# EAGLE design Encoder_AS5145B (EAGLE 6.6.0)
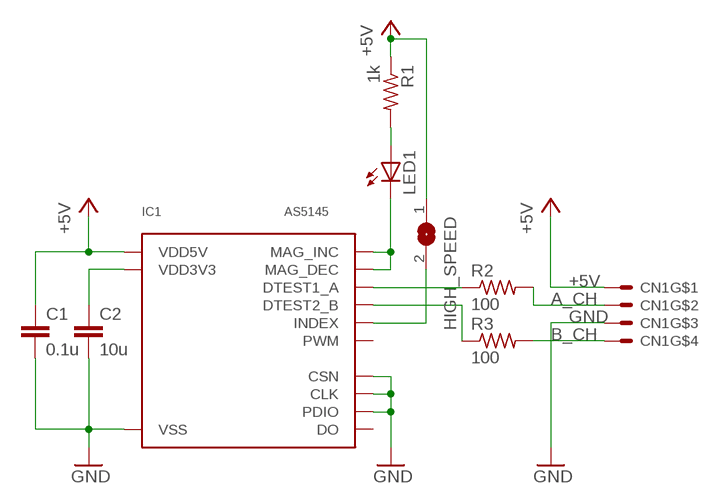
[diagram p0: schematic, sheet 1]

## Parts
C1  0.1u  C-EUC0603  [C0603]
C2  10u  CC2012  [C2012]
CN1  4B-XH-AS4B  [S4B-XH-A]
HIGH_SPEED  SJ  [SJ]
IC1  AS5145  [SSOP16-WIDE]
LED1  LEDCHIPLED_0805  [CHIPLED_0805]
R1  1k  R-US_R1608  [R1608]
R2  100  R-US_R1608  [R1608]
R3  100  R-US_R1608  [R1608]

## Nets
+5V: C1.1 CN1.1 HIGH_SPEED.1 IC1.16(VDD5V) R1.1
A_CH: CN1.2 R2.2
B_CH: CN1.4 R3.2
GND: C1.2 C2.2 CN1.3 IC1.7(VSS) IC1.8(PDIO) IC1.10(CLK) IC1.11(CSN)
N$1: LED1.A R1.2
N$2: IC1.4(DTEST2_B) R3.1
N$3: IC1.3(DTEST1_A) R2.1
N$7: HIGH_SPEED.2 IC1.6(INDEX)
N$8: C2.1 IC1.15(VDD3V3)
N$10: IC1.1(MAG_INC) IC1.2(MAG_DEC) LED1.C
Unconnected: IC1.5(NC1) IC1.9(DO) IC1.12(PWM) IC1.13(NC1) IC1.14(NC1)

## Library data of the parts
C1 = rcl:C-EU: CAPACITOR, European symbol
C2 = capacitor:C: CAPACITOR naming: grid - package width
CN1 = Con-JST:*4B-XH-A
HIGH_SPEED = Jumper:SJ: SMD solder JUMPER
IC1 = encoder:AS5145
LED1 = led:LED: LED OSRAM: - CHIPLED LG R971, LG N971, LY N971, LG Q971, LY Q971, LO R971, LY R971 LH N974, LH R974 LS Q976, LO Q976, LY Q976 LO Q996 - Hyper CHIPLED LW Q18S LB Q993, LB Q99A, LB R99A - SideLED LS A670, LO A670, LY A670, LG A670, LP A670 LB A673, LV A673, LT A673, LW A673 LH A674 LY A675 LS A676, LA A676, LO A676, LY A676, LW A676 LS A679, LY A679, LG A679 - Hyper Micro SIDELED® LS Y876, LA Y876, LO Y876, LY Y876 LT Y87S - SmartLED LW L88C, LW L88S LB L89C, LB L89S, LG L890 LS L89K, LO L89K, LY L89K LS L896, LA L896, LO L896, LY L896 - TOPLED LS T670, LO T670, LY T670, LG T670, LP T670 LSG T670, LSP T670, LSY T670, LOP T670, LYG T670 LG T671, LOG T671, LSG T671 LB T673, LV T673, LT T673, LW T673 LH T674 LS T676, LA T676, LO T676, LY T676, LB T676, LH T676, LSB T676, LW T676 LB T67C, LV T67C, LT T67C, LS T67K, LO T67K, LY T67K, LW E67C LS E67B, LA E67B, LO E67B, LY E67B, LB E67C, LV E67C, LT E67C LW T67C LS T679, LY T679, LG T679 LS T770, LO T770, LY T770, LG T770, LP T770 LB T773, LV T773, LT T773, LW T773 LH T774 LS E675, LA E675, LY E675, LS T675 LS T776, LA T776, LO T776, LY T776, LB T776 LHGB T686 LT T68C, LB T68C - Hyper Mini TOPLED® LB M676 - Mini TOPLED Santana® LG M470 LS M47K, LO M47K, LY M47K Source: http://www.osram.convergy.de/
R1-R3 = Registor:R-US_: RESISTOR, American symbol

## Board
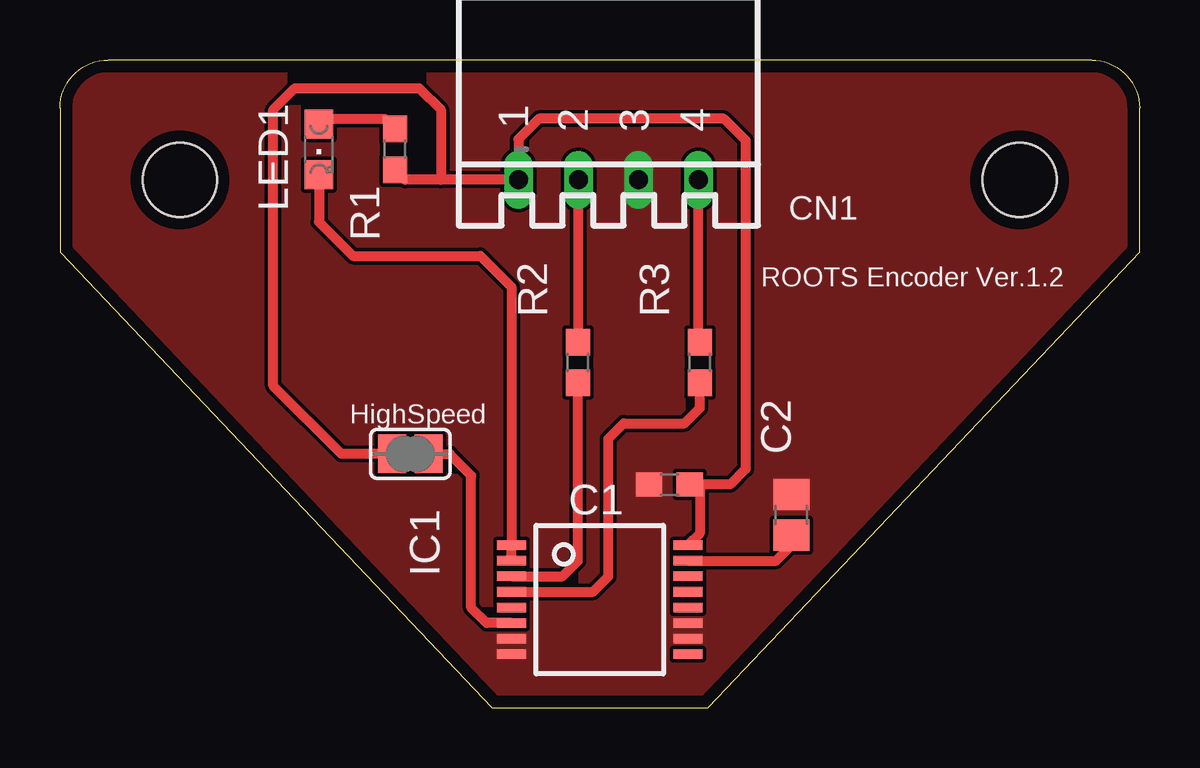
[diagram p1: board, top side]

Size 45 x 27 mm. Coordinates in mm from the lower left corner, seen from the top.
Outline: 45,19 45,25 arc90 43,27 2,27 arc90 0,25 0,19 18,0 27,0 45,19
Copper layers (1*16): Top 0.035mm / dielectric 1.6mm / Bottom 0.035mm
Design rules "Elecrow_2-layer_PCB_eagle_rule": minimum track width 6mil, minimum drill 12mil, track to track 6mil, track to pad 6mil, pad to pad 6mil, via to via 8mil, smd to smd 0mil, copper to edge 20mil, drill to drill 10mil, minimum pad ring 6mil, minimum via ring 6mil, stop-mask expansion 0mil, vias tented up to drill 100mil, thermal gap 10mil
Holes 3.1 mm at 5,22 40,22
tKeepout: area 2,19 to 8,25; area 37,19 to 43,25

### Footprints (pad centres in the part's own frame; a part is rotated, then mirrored left to right if it is on the bottom)
C0603 = smd 1.1 x 1: 1 -0.85,0; 2 0.85,0
C2012 = smd 1.3 x 1.5: 1 -0.85,0; 2 0.85,0
S4B-XH-A = drill 0.8 long: 1 3.75,0; 2 1.25,0; 3 -1.25,0; 4 -3.75,0
SJ = smd 1.168 x 1.6: 1 -0.762,0; 2 0.762,0
SSOP16-WIDE = smd 0.4 x 1.2: 1 -2.275,-3.68; 2 -1.625,-3.68; 3 -0.975,-3.68; 4 -0.325,-3.68; 5 0.325,-3.68; 6 0.975,-3.68; 7 1.625,-3.68; 8 2.275,-3.68; 9 2.275,3.68; 10 1.625,3.68; 11 0.975,3.68; 12 0.325,3.68; 13 -0.325,3.68; 14 -0.975,3.68; 15 -1.625,3.68; 16 -2.275,3.68
CHIPLED_0805 = smd 1.2 x 1.2: A 0,-1.05; C 0,1.05
R1608 = smd 1.1 x 1: 1 -0.85,0; 2 0.85,0

### Placement (x,y rotation side)
C1  25.4,9.3 180 top
C2  30.48,8.04 90 top
CN1  22.86,22.01 180 top
HIGH_SPEED  14.61,10.57 0 top
IC1  22.5,4.5 270 top
LED1  10.79,23.27 180 top
R1  13.97,23.27 90 top
R2  21.59,14.38 90 top
R3  26.67,14.38 90 top

### Tracks (layer width: path | path; a pad name or v marks a point on that pad's centre or on a via)
+5V
  Top 0.406: CN1.1 15.88,22.01 | 15.88,22.01 14.39,22.01 R1.1 | IC1.16 26.67,7.27 26.67,9.3 C1.1 27.94,9.3 28.57,9.94 28.57,23.65 27.68,24.55 19.97,24.55 19.11,23.69 CN1.1 | CN1.1 19.05,22.01 | HIGH_SPEED.1 11.73,10.57 8.89,13.41 8.89,24.92 9.79,25.81 14.98,25.81 15.88,24.92 15.88,22.01
A_CH
  Top 0.406: R2.2 21.61,15.23 CN1.2
B_CH
  Top 0.406: R3.2 26.61,15.23 CN1.4
GND
  pour Top (no thermals): -0.64,27.72 -0.64,-14.27 46.35,-14.27 46.35,27.72
N$1
  Top 0.406: LED1.A 10.79,24.55 13.55,24.55 R1.2
N$2
  Top 0.406: IC1.4 22.22,4.82 22.86,5.46 22.86,11.21 23.5,11.84 26.04,11.84 26.67,12.48 R3.1
N$3
  Top 0.406: IC1.3 20.95,5.48 21.59,6.11 R2.1
N$7
  Top 0.406: HIGH_SPEED.2 16.25,10.57 17.14,9.68 17.14,4.16 17.78,3.52 IC1.6
N$8
  Top 0.406: IC1.15 29.84,6.12 30.48,6.76 C2.1
N$10
  Top 0.406: IC1.2 IC1.1 18.82,17.54 17.53,18.83 12.21,18.83 10.79,20.25 LED1.C

### Text on the board
tPlace: ROOTS Encoder Ver.1.2 | HighSpeed